# EAGLE schematic untitled (EAGLE 6.3)
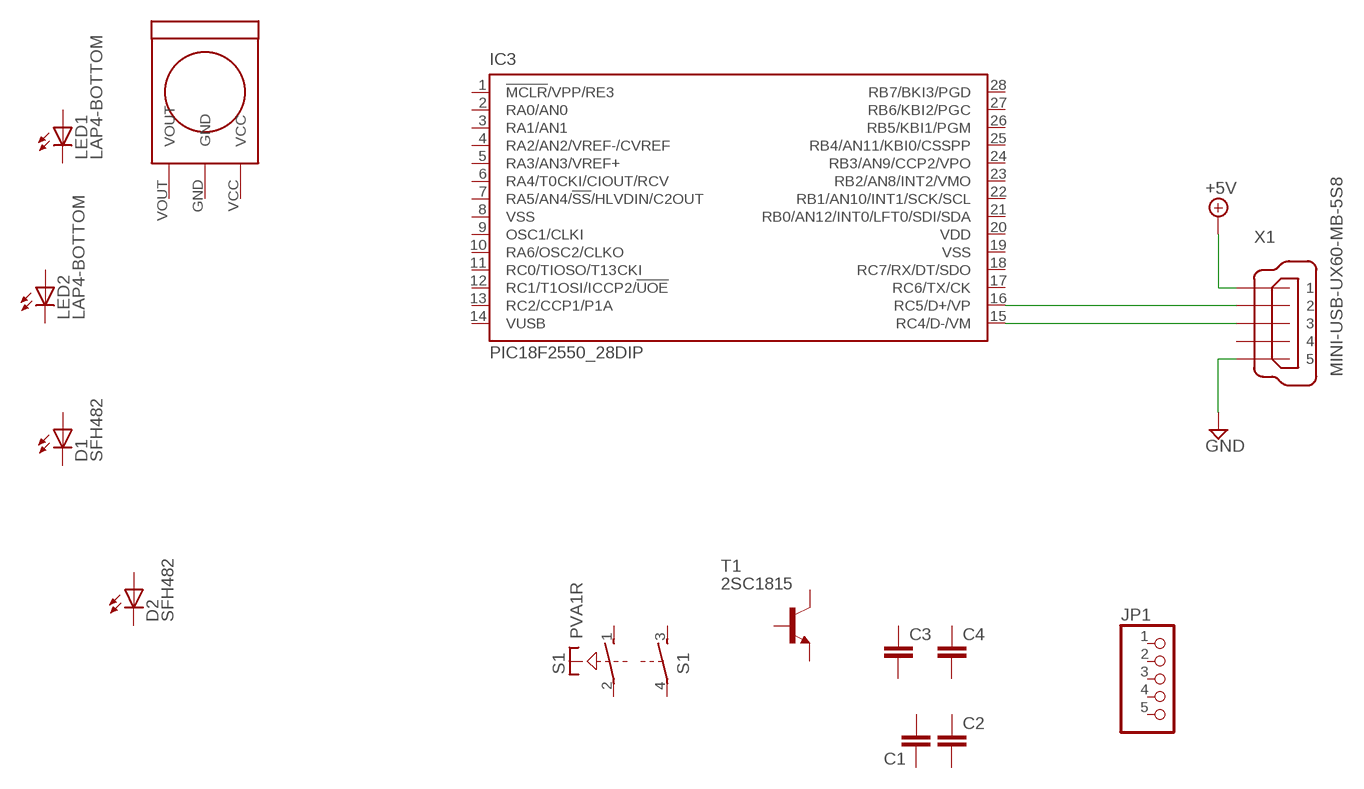
[diagram p0: schematic, sheet 1]

## Parts
C1  C-EU025-024X044  [C025-024X044]
C2  C-EU025-024X044  [C025-024X044]
C3  C-EU025-024X044  [C025-024X044]
C4  C-EU025-024X044  [C025-024X044]
D1  SFH482  [SFH482]
D2  SFH482  [SFH482]
IC3  PIC18F2550_28DIP  [DIL28-3]
JP1  PINHD-1X5/90  [1X05/90]
LED1  LAP4-BOTTOM  [P47F-BOTTOM]
LED2  LAP4-BOTTOM  [P47F-BOTTOM]
S1  PVA1R  [PVA1R]
T1  2SC1815  [TO92-ECB]
U$1  IRM2161  [PL-IRM2161-C438]
X1  MINI-USB-UX60-MB-5S8  [UX60-MB-5S8]

## Nets
+5V: X1.1
GND: X1.5
N$1: IC3.16(RC5/D+/VP) X1.2
N$2: IC3.15(RC4/D-/VM) X1.3
Unconnected: C1.1 C1.2 C2.1 C2.2 C3.1 C3.2 C4.1 C4.2 D1.A D1.K(C) D2.A D2.K(C) IC3.1(!MCLR!/VPP/RE3) IC3.2(RA0/AN0) IC3.3(RA1/AN1) IC3.4(RA2/AN2/VREF-/CVREF) IC3.5(RA3/AN3/VREF+) IC3.6(RA4/T0CKI/CIOUT/RCV) IC3.7(RA5/AN4/!SS!/HLVDIN/C2OUT) IC3.9(OSC1/CLKI) IC3.10(RA6/OSC2/CLKO) IC3.11(RC0/TIOSO/T13CKI) IC3.12(RC1/T1OSI/ICCP2/!UOE) IC3.13(RC2/CCP1/P1A) IC3.14(VUSB) IC3.17(RC6/TX/CK) IC3.18(RC7/RX/DT/SDO) IC3.21(RB0/AN12/INT0/LFT0/SDI/SDA) IC3.22(RB1/AN10/INT1/SCK/SCL) IC3.23(RB2/AN8/INT2/VMO) IC3.24(RB3/AN9/CCP2/VPO) IC3.25(RB4/AN11/KBI0/CSSPP) IC3.26(RB5/KBI1/PGM) IC3.27(RB6/KBI2/PGC) IC3.28(RB7/BKI3/PGD) JP1.1 JP1.2 JP1.3 JP1.4 JP1.5 LED1.A LED1.C LED2.A LED2.C S1.1(1:S) S1.2(1:P) S1.3(2:S) S1.4(2:P) T1.B T1.C T1.E U$1.GND U$1.VCC U$1.VOUT X1.4

## Power pins joined to a net without a drawn wire
VDD: IC3.20(VDD)
VSS: IC3.8(VSS) IC3.19(VSS)

## Library data of the parts
C1-C4 = rcl:C-EU: CAPACITOR, European symbol
D1 D2 = led:SFH482: IR LED infrared emitting diode, Infineon
IC3 = microchip:PIC18F2*_28: USB Microcontrollers with nanoWatt Technology High-Performance, Enhanced Flash, 28/40/44-Pin, Source: http://ww1.microchip.com/downloads/en/devicedoc/39632c.pdf; MF: MICROCHIP; MPN: PIC18F2550-I/SP; OC_FARNELL: 1523822; OC_NEWARK: 80K6054
JP1 = pinhead:PINHD-1X5: PIN HEADER
LED1 LED2 = led:*P4: PointLED® Enhanced Thinfilm LED TOP & BOTTOM mount LS P47F, LR P47F, LA P47F, LY P47F, LT P4SG, LB P4SG, LW P4SG Source: http://catalog.osram-os.com .. LA_LR_LS_LY_P47F_Pb_free.pdf
S1 = switch-misc:PVA1R: ITT SWITCH
T1 = transistor:2SC1815: NPN EPITAXIAL TRANSISTOR Source: TOSHIBA .. 2SC1815 1.pdf
U$1 = IRM2161:IRM2161: PL-IRM2161-C438 from maritex.com.pl by Grzegorz Rajtar mcgregor@blackmesaeast.com.pl
X1 = con-hirose:MINI-USB-: MINI USB Connector Source: http://www.hirose.co.jp/cataloge_hp/e24000019.pdf; OC_FARNELL: unknown; OC_NEWARK: unknown